# EAGLE schematic led-er-v3 (EAGLE 7.5.0)
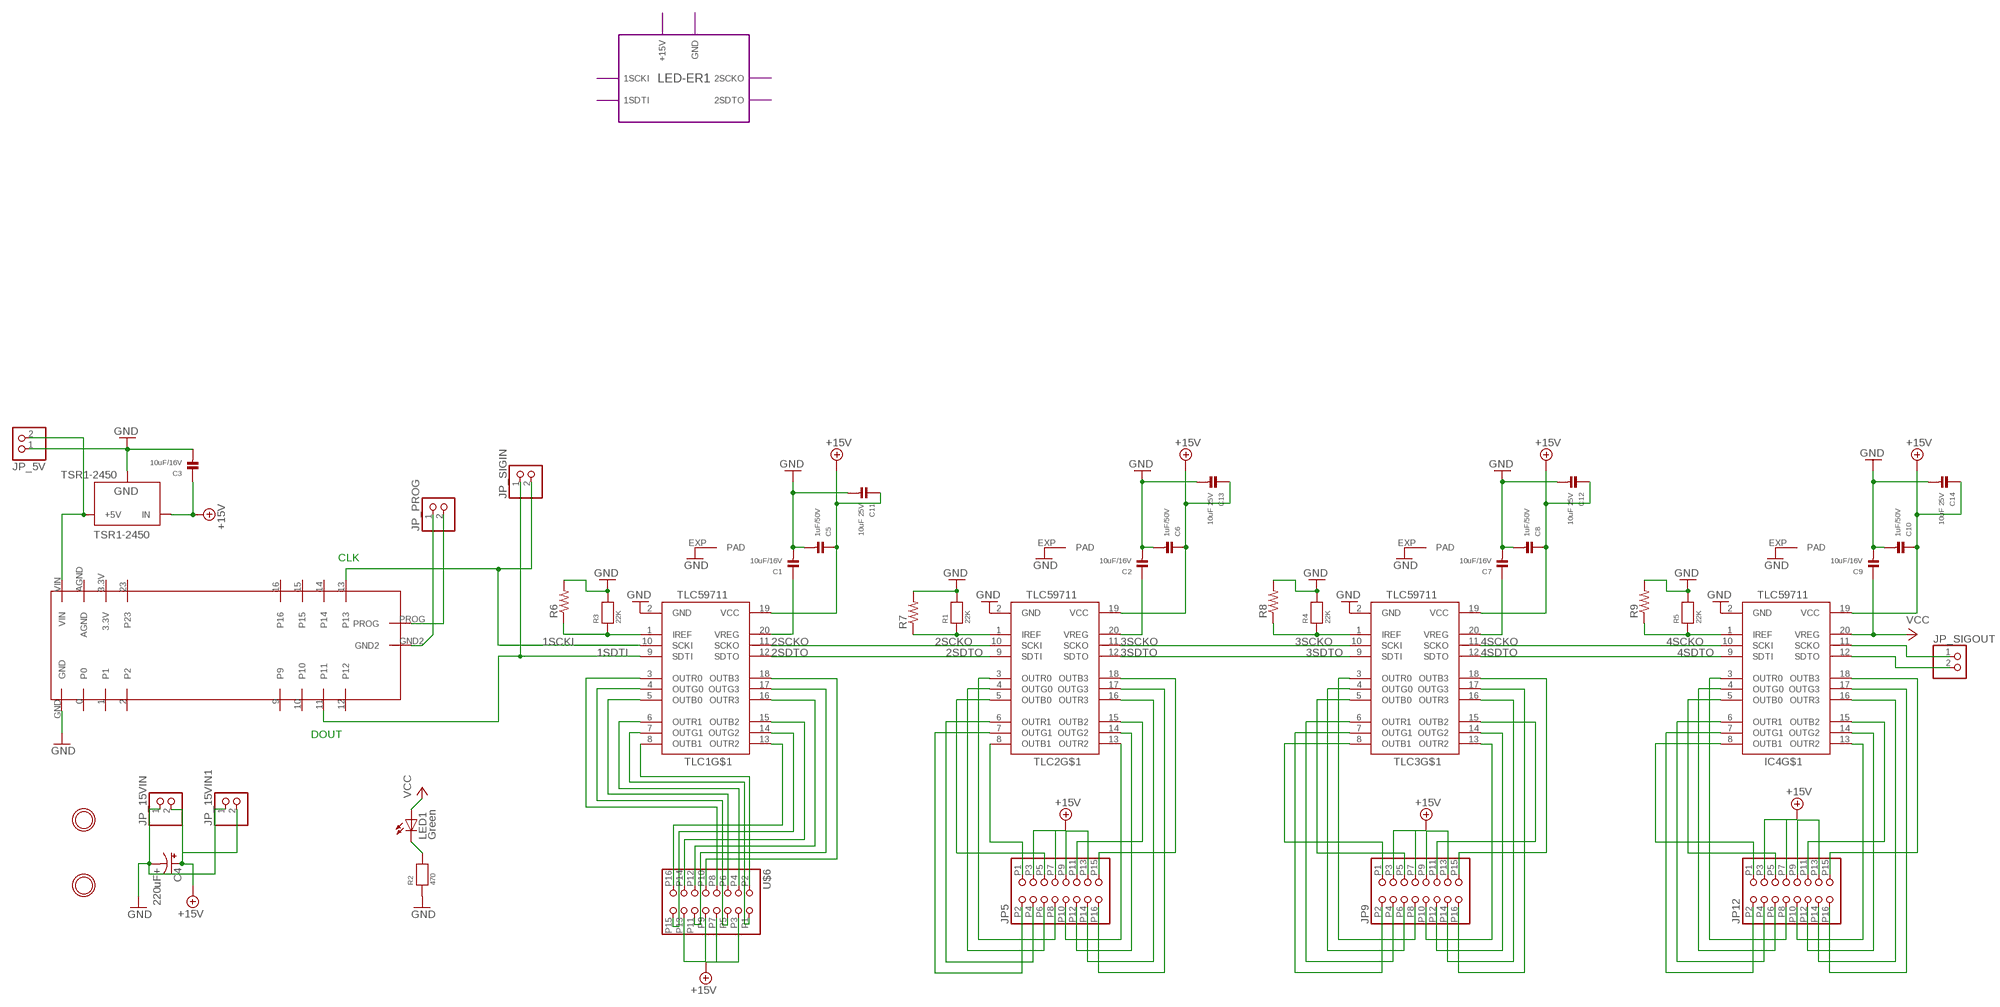
[diagram p0: schematic, sheet 1]

## Parts
C1  10uF/16V  CAP_CERAMIC0805  [0805]
C2  10uF/16V  CAP_CERAMIC0805  [0805]
C3  10uF/16V  CAP_CERAMIC0805  [0805]
C4  220uF+  CPOL-USE5-8.5  [E5-8,5]
C5  1uF/50V  CAP_CERAMIC0805  [0805]
C6  1uF/50V  CAP_CERAMIC0805  [0805]
C7  10uF/16V  CAP_CERAMIC0805  [0805]
C8  1uF/50V  CAP_CERAMIC0805  [0805]
C9  10uF/16V  CAP_CERAMIC0805  [0805]
C10  1uF/50V  CAP_CERAMIC0805  [0805]
C11  10uF 25V  CAP_CERAMIC0805  [0805]
C12  10uF 25V  CAP_CERAMIC0805  [0805]
C13  10uF 25V  CAP_CERAMIC0805  [0805]
C14  10uF 25V  CAP_CERAMIC0805  [0805]
IC4  TLC59711  [HTSSOP20DAP]
JP5  HEADER-2X8-RIBBON  [2X08_RIBBON]
JP9  HEADER-2X8-RIBBON  [2X08_RIBBON]
JP12  HEADER-2X8-RIBBON  [2X08_RIBBON]
JP_5V  HEADER-1X2  [1X02_OVAL]
JP_15VIN  HEADER-1X2  [1X02_OVAL]
JP_15VIN1  HEADER-1X2  [1X02_OVAL]
JP_PROG  HEADER-1X2  [1X02_OVAL]
JP_SIGIN  HEADER-1X2  [1X02_OVAL]
JP_SIGOUT  HEADER-1X2  [1X02_OVAL]
LED1  Green  LEDCHIP-LED0805  [CHIP-LED0805]
R1  22K  RESISTOR0805  [0805]
R2  470  RESISTOR0805  [0805]
R3  22K  RESISTOR0805  [0805]
R4  22K  RESISTOR0805  [0805]
R5  22K  RESISTOR0805  [0805]
R6  R-US_0207/9  [0207/9]
R7  R-US_0207/10  [0207/10]
R8  R-US_0207/9  [0207/9]
R9  R-US_0207/9  [0207/9]
TLC1  TLC59711  [HTSSOP20DAP]
TLC2  TLC59711  [HTSSOP20DAP]
TLC3  TLC59711  [HTSSOP20DAP]
TSR1-2450  TSR1-2450  [TSR-1]
U$1  MOUNTINGHOLE  [MOUNTINGHOLE_3.0_PLATED]
U$3  MOUNTINGHOLE  [MOUNTINGHOLE_3.0_PLATED]
U$5  TEENSY_LEDER  [TEENSY_LEDER]
U$6  HEADER-2X8-RIBBON  [2X08_RIBBON]

## Module instances
LED-ER1 = LED-ER

## Nets
1SCKI: JP_SIGIN.2 TLC1.10(SCKI) U$5.13
1SDTI: JP_SIGIN.1 TLC1.9(SDTI) U$5.11
2SCKO: TLC1.11(SCKO) TLC2.10(SCKI)
2SDTO: TLC1.12(SDTO) TLC2.9(SDTI)
3SCKO: TLC2.11(SCKO) TLC3.10(SCKI)
3SDTO: TLC2.12(SDTO) TLC3.9(SDTI)
4SCKO: IC4.10(SCKI) TLC3.11(SCKO)
4SDTO: IC4.9(SDTI) TLC3.12(SDTO)
+15V: C3.1 C4.+ C5.1 C6.1 C8.1 C10.1 C11.1 C12.1 C13.1 C14.1 IC4.19(VCC) JP5.P3 JP5.P7 JP5.P9 JP5.P13 JP9.P3 JP9.P7 JP9.P9 JP9.P13 JP12.P3 JP12.P7 JP12.P9 JP12.P13 JP_15VIN1.2 JP_15VIN.2 TLC1.19(VCC) TLC2.19(VCC) TLC3.19(VCC) TSR1-2450.1(IN) U$6.P3 U$6.P7 U$6.P9 U$6.P13
GND: C1.2 C2.2 C3.2 C4.- C5.2 C6.2 C7.2 C8.2 C9.2 C10.2 C11.2 C12.2 C13.2 C14.2 IC4.2(GND) IC4.EXP(PAD) JP_5V.1 JP_15VIN1.1 JP_15VIN.1 R1.2 R2.1 R3.2 R4.2 R5.2 R6.2 R7.2 R8.2 R9.2 TLC1.2(GND) TLC1.EXP(PAD) TLC2.2(GND) TLC2.EXP(PAD) TLC3.2(GND) TLC3.EXP(PAD) TSR1-2450.2(GND) U$5.GND
JP1: JP_5V.2 TSR1-2450.3(+5V) U$5.VIN
N$1: LED1.C R2.2
N$2: R3.1 R6.1 TLC1.1(IREF)
N$3: TLC1.8(OUTB1) U$6.P2
N$4: TLC1.7(OUTG1) U$6.P1
N$5: TLC1.6(OUTR1) U$6.P4
N$6: TLC1.5(OUTB0) U$6.P6
N$7: JP5.P2 TLC2.7(OUTG1)
N$8: JP5.P4 TLC2.6(OUTR1)
N$9: JP5.P5 TLC2.5(OUTB0)
N$10: JP5.P6 TLC2.4(OUTG0)
N$11: TLC1.4(OUTG0) U$6.P5
N$12: TLC1.3(OUTR0) U$6.P8
N$13: TLC1.15(OUTB2) U$6.P14
N$14: TLC1.18(OUTB3) U$6.P10
N$15: R1.1 R7.1 TLC2.1(IREF)
N$16: JP9.P1 TLC3.8(OUTB1)
N$17: JP5.P10 TLC2.13(OUTR2)
N$18: JP9.P6 TLC3.4(OUTG0)
N$19: IC4.7(OUTG1) JP12.P2
N$20: JP9.P2 TLC3.7(OUTG1)
N$21: IC4.6(OUTR1) JP12.P4
N$22: JP9.P4 TLC3.6(OUTR1)
N$23: JP5.P12 TLC2.14(OUTG2)
N$24: JP5.P11 TLC2.15(OUTB2)
N$25: JP5.P14 TLC2.16(OUTR3)
N$26: JP5.P16 TLC2.17(OUTG3)
N$27: JP5.P15 TLC2.18(OUTB3)
N$28: R4.1 R8.1 TLC3.1(IREF)
N$29: JP9.P12 TLC3.14(OUTG2)
N$30: JP5.P1 TLC2.8(OUTB1)
N$31: JP9.P10 TLC3.13(OUTR2)
N$32: TLC1.17(OUTG3) U$6.P11
N$33: TLC1.16(OUTR3) U$6.P12
N$34: TLC1.14(OUTG2) U$6.P15
N$35: TLC1.13(OUTR2) U$6.P16
N$37: JP9.P11 TLC3.15(OUTB2)
N$38: JP9.P14 TLC3.16(OUTR3)
N$39: JP9.P16 TLC3.17(OUTG3)
N$40: JP9.P15 TLC3.18(OUTB3)
N$41: IC4.1(IREF) R5.1 R9.1
N$42: JP5.P8 TLC2.3(OUTR0)
N$43: IC4.13(OUTR2) JP12.P10
N$44: JP9.P5 TLC3.5(OUTB0)
N$49: IC4.14(OUTG2) JP12.P12
N$50: IC4.15(OUTB2) JP12.P11
N$51: IC4.16(OUTR3) JP12.P14
N$52: IC4.17(OUTG3) JP12.P16
N$53: IC4.18(OUTB3) JP12.P15
N$54: JP_PROG.1 U$5.GND2
N$55: JP_PROG.2 U$5.PROG
N$56: C1.1 TLC1.20(VREG)
N$57: C7.1 TLC3.20(VREG)
N$58: C2.1 TLC2.20(VREG)
N$59: IC4.11(SCKO) JP_SIGOUT.1
N$60: IC4.12(SDTO) JP_SIGOUT.2
N$61: JP9.P8 TLC3.3(OUTR0)
N$62: IC4.3(OUTR0) JP12.P8
N$71: IC4.4(OUTG0) JP12.P6
N$79: IC4.5(OUTB0) JP12.P5
N$80: IC4.8(OUTB1) JP12.P1
VCC: C9.1 IC4.20(VREG) LED1.A
Unconnected: U$5.0 U$5.1 U$5.2 U$5.3.3V U$5.9 U$5.10 U$5.12 U$5.14 U$5.15 U$5.16 U$5.23 U$5.AGND

## Notes on the sheet
- CLK
- DOUT

## Library data of the parts
C1-C3 C5-C14 = microbuilder:CAP_CERAMIC: Ceramic Capacitors 0402 - 0402 Surface Mount Capacitors 16pF 50V 5% [Digikey: 445-4899-2-ND] 18pF 50V 5% [Digikey: 490-1281-2-ND] 22pF 50V 5% [Digikey: 490-1283-2-ND] 68pF 50V 5% [Digikey: 490-1289-2-ND] 0.1uF 10V 10% [Digikey: 490-1318-2-ND] 1.0uF 6.3V 10% [Digikey: 490-1320-2-ND] 0603 - 0603 Surface Mount Capacitors 16 pF 50V 5% [Digikey: 445-5051-2-ND] 22 pF 50V [Digikey: PCC220ACVTR-ND] 33 pF 50V 5% [Digikey: 490-1415-1-ND] 56pF 50V 5% [Digikey: 490-1421-1-ND] 220pF 50V 5% [Digikey: 445-1285-1-ND] 680 pF 50V 2200 pF 50V 5% C0G [Digikey: 445-1297-1-ND] 5600 pF 100V 5% X7R [Digikey: 478-3711-1-ND] 0.1 µF 25V 10% [Digikey: PCC2277TR-ND] 0.22 µF 16V 10% X7R [Digikey: 445-1318-1-ND] 1.0 µF 25V 10% [Digikey: 445-5146-2-ND] 0603 - RF Specific 3pF 250V +/-0.1pF RF [Digikey: 712-1347-1-ND] 18 pF 250V 5% [Digikey: 478-3505-1-ND or 712-1322-1-ND] 56 pF 250V 5% C0G RF [Digikey: 490-4867-1-ND] 68 pF 250V RF [Digikey: 490-4868-1-ND] 0805 - 0805 Surface Mount Capacitors 220 pF 250V 2% RF Ceramic Capacitor [Digikey: 712-1398-1-ND] 1000 pF 50V 2% NP0 Ceramic Capacitor [Digikey: 478-3760-1-ND] 0.1 µF 25V 10% Ceramic Capacitor [Digikey: PCC1828TR-ND] 1.0 µF 16V 10% Ceramic Capacitor[Digikey: 490-1691-2-ND] 10.0 µF 10V 10% Ceramic Capacitor[Digikey: 709-1228-1-ND] 10.0 uF 16V 10% Ceramic Capacitor [Digikey: 478-5165-2-ND] 47 uF 6.3V 20% Ceramic Capacitor [Digikey: 587-1779-1-ND or 399-5506-1-ND] 1206 - 1206 Surface Mount Capacitors 47uF 10V 20% Ceramic Capacitor [Digikey: 490-5528-1-ND or 399-5508-1-ND or 445-6010-1-ND] 100uF 6.3V -20%, +80% Y5V Ceramic Capacitor (Digikey: 490-4512-1-ND, Mouser: 81-GRM31CF50J107ZE1L)
C4 = adafruit:CPOL-US: POLARIZED CAPACITOR, American symbol
IC4 TLC1-TLC3 = adafruit:TLC59711
JP5 JP9 JP12 U$6 = Andrews:HEADER-2X8-RIBBON
JP_5V JP_15VIN JP_15VIN1 JP_PROG JP_SIGIN JP_SIGOUT = microbuilder:HEADER-1X2: PIN HEADER
LED1 = adafruit:LED: LED OSRAM: - CHIPLED LG R971, LG N971, LY N971, LG Q971, LY Q971, LO R971, LY R971 LH N974, LH R974 LS Q976, LO Q976, LY Q976 LO Q996 - Hyper CHIPLED LW Q18S LB Q993, LB Q99A, LB R99A - SideLED LS A670, LO A670, LY A670, LG A670, LP A670 LB A673, LV A673, LT A673, LW A673 LH A674 LY A675 LS A676, LA A676, LO A676, LY A676, LW A676 LS A679, LY A679, LG A679 - Hyper Micro SIDELED® LS Y876, LA Y876, LO Y876, LY Y876 LT Y87S - SmartLED LW L88C, LW L88S LB L89C, LB L89S, LG L890 LS L89K, LO L89K, LY L89K LS L896, LA L896, LO L896, LY L896 - TOPLED LS T670, LO T670, LY T670, LG T670, LP T670 LSG T670, LSP T670, LSY T670, LOP T670, LYG T670 LG T671, LOG T671, LSG T671 LB T673, LV T673, LT T673, LW T673 LH T674 LS T676, LA T676, LO T676, LY T676, LB T676, LH T676, LSB T676, LW T676 LB T67C, LV T67C, LT T67C, LS T67K, LO T67K, LY T67K, LW E67C LS E67B, LA E67B, LO E67B, LY E67B, LB E67C, LV E67C, LT E67C LW T67C LS T679, LY T679, LG T679 LS T770, LO T770, LY T770, LG T770, LP T770 LB T773, LV T773, LT T773, LW T773 LH T774 LS E675, LA E675, LY E675, LS T675 LS T776, LA T776, LO T776, LY T776, LB T776 LHGB T686 LT T68C, LB T68C - Hyper Mini TOPLED® LB M676 - Mini TOPLED Santana® LG M470 LS M47K, LO M47K, LY M47K Source: http://www.osram.convergy.de/
R1-R5 = microbuilder:RESISTOR: Resistors 0402 - 0402 Surface Mount Package 22 Ohm 1% 1/16W [Digikey: 311-22.0LRTR-ND] 33 Ohm 5% 1/16W 1.0K 5% 1/16W 1.5K 5% 1/16W 2.0K 1% 1/16W 10.0K 1% 1/16W [Digikey: 311-10.0KLRTR-ND] 10.0K 5% 1/16W [Digikey: RMCF0402JT10K0TR-ND] 12.1K 1% 1/16W [Digikey: 311-22.0LRTR-ND] 100.0K 5% 1/16W 0603 - 0603 Surface Mount Package 0 Ohm 1/10 Watt 1% Resistor 15 Ohm 1/10 Watt 1% Resistor 33 Ohm 1/10 Watt 1% Resistor 49.9 Ohm 1/10 Watt 1% Resistor 100 Ohm 1/10 Watt 1% Resistor 150 Ohm 1/10 Watt 1% Resistor 240 Ohm 1/10 Watt 1% Resistor 390 Ohm 1/10 Watt 1% Resistor 560 Ohm 1/10 Watt 1% Resistor 680 Ohm 1/10 Watt 1% Resistor 750 Ohm 1/10 Watt 1% Resistor 1.0K Ohm 1/10 Watt 1% Resistor 1.5K Ohm 1/10 Watt 1% Resistor 2.0K Ohm 1/10 Watt 1% Resistor 2.2K Ohm 1/10 Watt 1% Resistor 3.3K Ohm 1/10 Watt 1% Resistor 4.7K Ohm 1/10 Watt 1% Resistor 10.0K Ohm 1/10 Watt 1% Resistor 12.0K Ohm 1/10 Watt 1% Resistor 12.1K Ohm 1/10 Watt 1% Resistor 20.0K Ohm 1/10 Watt 1% Resistor 33.0K Ohm 1/10 Watt 1% Resistor 100.0K Ohm 1/10 Watt 1% Resistor 0805 - 0805 Surface Mount Package 0 Ohm 1/8 Watt 1% Resistor 33 Ohm 1/8 Watt 1% Resistor 100 Ohm 1/8 Watt 1% Resistor 150 Ohm 1/8 Watt 1% Resistor 200 Ohm 1/8 Watt 1% Resistor 240 Ohm 1/8 Watt 1% Resistor 330 Ohm 1/8 Watt 1% Resistor 390 Ohm 1/8 Watt 1% Resistor 470 Ohm 1/8 Watt 1% Resistor 1.0K Ohm 1/8 Watt 1% Resistor 1.5K Ohm 1/8 Watt 1% Resistor 2.0K Ohm 1/8 Watt 1% Resistor 4.7K Ohm 1/8 Watt 1% Resistor 5.1K Ohm 1/8 Watt 1% Resistor 5.6K Ohm 1/8 Watt 1% Resistor 10.0K Ohm 1/8 Watt 1% Resistor 22.0K Ohm 1/8 Watt 1% Resistor 33.0K Ohm 1/8 Watt 1% Resistor 100K Ohm 1/8 Watt 1% Resistor 1206 - 1206 Surface Mount Package 2012 - 2010 Surface Mount Package 0.11 Ohm 1/2 Watt 1% Resistor - Digikey: RHM.11UCT-ND
R6-R9 = adafruit:R-US_: RESISTOR, American symbol
TSR1-2450 = SteelCaveRobotics-Power:TSR1-2450: Traco Power TSR 1-2450 5.0v switching regulator
U$1 U$3 = microbuilder:MOUNTINGHOLE: Mounting Hole For #2 screws (0.086"/2.18mm width, 0.094"/2.4mm hole) use 2.5mm
U$5 = Andrews:TEENSY_LEDER

## Module LED-ER
Ports: 1SCKI(io) 1SDTI(io) 2SCKO(io) 2SDTO(io) +15V(io) GND(io)
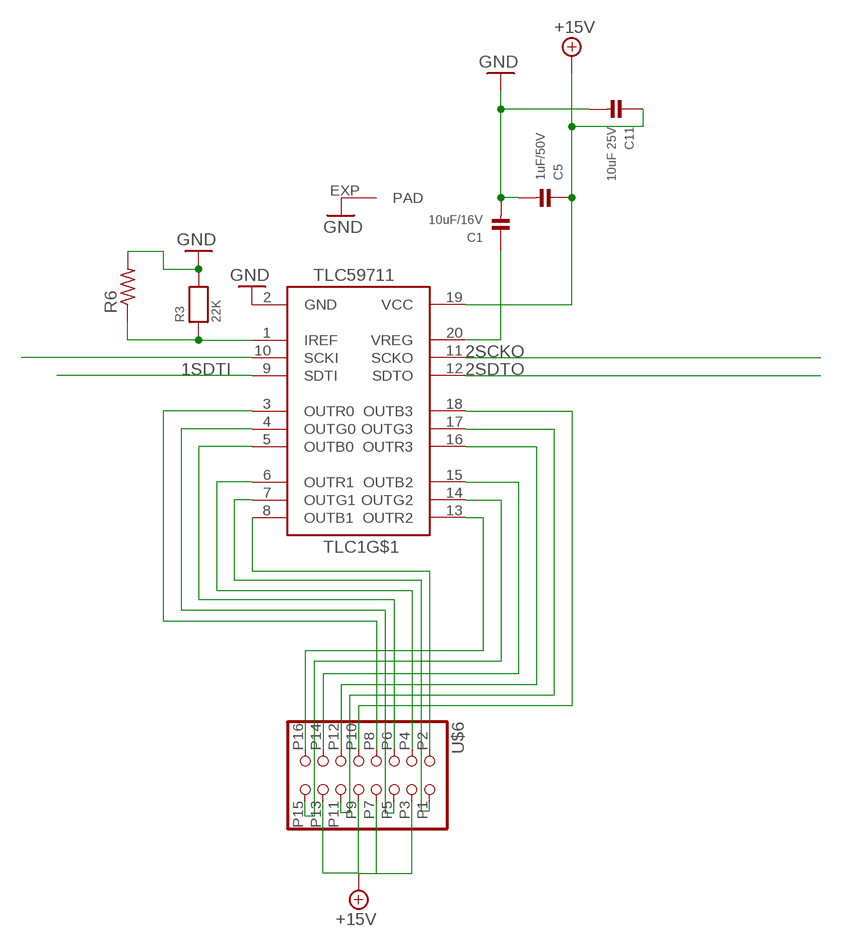
[diagram p1: schematic, module LED-ER, sheet 1]

### Parts
C1  10uF/16V  CAP_CERAMIC0805  [0805]
C5  1uF/50V  CAP_CERAMIC0805  [0805]
C11  10uF 25V  CAP_CERAMIC0805  [0805]
R3  22K  RESISTOR0805  [0805]
R6  R-US_0207/9  [0207/9]
TLC1  TLC59711  [HTSSOP20DAP]
U$6  HEADER-2X8-RIBBON  [2X08_RIBBON]

### Nets
1SCKI: TLC1.10(SCKI)
1SDTI: TLC1.9(SDTI)
2SCKO: TLC1.11(SCKO)
2SDTO: TLC1.12(SDTO)
+15V: C5.1 C11.1 TLC1.19(VCC) U$6.P3 U$6.P7 U$6.P9 U$6.P13
GND: C1.2 C5.2 C11.2 R3.2 R6.2 TLC1.2(GND) TLC1.EXP(PAD)
N$2: R3.1 R6.1 TLC1.1(IREF)
N$3: TLC1.8(OUTB1) U$6.P2
N$4: TLC1.7(OUTG1) U$6.P1
N$5: TLC1.6(OUTR1) U$6.P4
N$6: TLC1.5(OUTB0) U$6.P6
N$11: TLC1.4(OUTG0) U$6.P5
N$12: TLC1.3(OUTR0) U$6.P8
N$13: TLC1.15(OUTB2) U$6.P14
N$14: TLC1.18(OUTB3) U$6.P10
N$32: TLC1.17(OUTG3) U$6.P11
N$33: TLC1.16(OUTR3) U$6.P12
N$34: TLC1.14(OUTG2) U$6.P15
N$35: TLC1.13(OUTR2) U$6.P16
N$56: C1.1 TLC1.20(VREG)

### Library data of the parts
C1 C5 C11 = microbuilder:CAP_CERAMIC: Ceramic Capacitors 0402 - 0402 Surface Mount Capacitors 16pF 50V 5% [Digikey: 445-4899-2-ND] 18pF 50V 5% [Digikey: 490-1281-2-ND] 22pF 50V 5% [Digikey: 490-1283-2-ND] 68pF 50V 5% [Digikey: 490-1289-2-ND] 0.1uF 10V 10% [Digikey: 490-1318-2-ND] 1.0uF 6.3V 10% [Digikey: 490-1320-2-ND] 0603 - 0603 Surface Mount Capacitors 16 pF 50V 5% [Digikey: 445-5051-2-ND] 22 pF 50V [Digikey: PCC220ACVTR-ND] 33 pF 50V 5% [Digikey: 490-1415-1-ND] 56pF 50V 5% [Digikey: 490-1421-1-ND] 220pF 50V 5% [Digikey: 445-1285-1-ND] 680 pF 50V 2200 pF 50V 5% C0G [Digikey: 445-1297-1-ND] 5600 pF 100V 5% X7R [Digikey: 478-3711-1-ND] 0.1 µF 25V 10% [Digikey: PCC2277TR-ND] 0.22 µF 16V 10% X7R [Digikey: 445-1318-1-ND] 1.0 µF 25V 10% [Digikey: 445-5146-2-ND] 0603 - RF Specific 3pF 250V +/-0.1pF RF [Digikey: 712-1347-1-ND] 18 pF 250V 5% [Digikey: 478-3505-1-ND or 712-1322-1-ND] 56 pF 250V 5% C0G RF [Digikey: 490-4867-1-ND] 68 pF 250V RF [Digikey: 490-4868-1-ND] 0805 - 0805 Surface Mount Capacitors 220 pF 250V 2% RF Ceramic Capacitor [Digikey: 712-1398-1-ND] 1000 pF 50V 2% NP0 Ceramic Capacitor [Digikey: 478-3760-1-ND] 0.1 µF 25V 10% Ceramic Capacitor [Digikey: PCC1828TR-ND] 1.0 µF 16V 10% Ceramic Capacitor[Digikey: 490-1691-2-ND] 10.0 µF 10V 10% Ceramic Capacitor[Digikey: 709-1228-1-ND] 10.0 uF 16V 10% Ceramic Capacitor [Digikey: 478-5165-2-ND] 47 uF 6.3V 20% Ceramic Capacitor [Digikey: 587-1779-1-ND or 399-5506-1-ND] 1206 - 1206 Surface Mount Capacitors 47uF 10V 20% Ceramic Capacitor [Digikey: 490-5528-1-ND or 399-5508-1-ND or 445-6010-1-ND] 100uF 6.3V -20%, +80% Y5V Ceramic Capacitor (Digikey: 490-4512-1-ND, Mouser: 81-GRM31CF50J107ZE1L)
R3 = microbuilder:RESISTOR: Resistors 0402 - 0402 Surface Mount Package 22 Ohm 1% 1/16W [Digikey: 311-22.0LRTR-ND] 33 Ohm 5% 1/16W 1.0K 5% 1/16W 1.5K 5% 1/16W 2.0K 1% 1/16W 10.0K 1% 1/16W [Digikey: 311-10.0KLRTR-ND] 10.0K 5% 1/16W [Digikey: RMCF0402JT10K0TR-ND] 12.1K 1% 1/16W [Digikey: 311-22.0LRTR-ND] 100.0K 5% 1/16W 0603 - 0603 Surface Mount Package 0 Ohm 1/10 Watt 1% Resistor 15 Ohm 1/10 Watt 1% Resistor 33 Ohm 1/10 Watt 1% Resistor 49.9 Ohm 1/10 Watt 1% Resistor 100 Ohm 1/10 Watt 1% Resistor 150 Ohm 1/10 Watt 1% Resistor 240 Ohm 1/10 Watt 1% Resistor 390 Ohm 1/10 Watt 1% Resistor 560 Ohm 1/10 Watt 1% Resistor 680 Ohm 1/10 Watt 1% Resistor 750 Ohm 1/10 Watt 1% Resistor 1.0K Ohm 1/10 Watt 1% Resistor 1.5K Ohm 1/10 Watt 1% Resistor 2.0K Ohm 1/10 Watt 1% Resistor 2.2K Ohm 1/10 Watt 1% Resistor 3.3K Ohm 1/10 Watt 1% Resistor 4.7K Ohm 1/10 Watt 1% Resistor 10.0K Ohm 1/10 Watt 1% Resistor 12.0K Ohm 1/10 Watt 1% Resistor 12.1K Ohm 1/10 Watt 1% Resistor 20.0K Ohm 1/10 Watt 1% Resistor 33.0K Ohm 1/10 Watt 1% Resistor 100.0K Ohm 1/10 Watt 1% Resistor 0805 - 0805 Surface Mount Package 0 Ohm 1/8 Watt 1% Resistor 33 Ohm 1/8 Watt 1% Resistor 100 Ohm 1/8 Watt 1% Resistor 150 Ohm 1/8 Watt 1% Resistor 200 Ohm 1/8 Watt 1% Resistor 240 Ohm 1/8 Watt 1% Resistor 330 Ohm 1/8 Watt 1% Resistor 390 Ohm 1/8 Watt 1% Resistor 470 Ohm 1/8 Watt 1% Resistor 1.0K Ohm 1/8 Watt 1% Resistor 1.5K Ohm 1/8 Watt 1% Resistor 2.0K Ohm 1/8 Watt 1% Resistor 4.7K Ohm 1/8 Watt 1% Resistor 5.1K Ohm 1/8 Watt 1% Resistor 5.6K Ohm 1/8 Watt 1% Resistor 10.0K Ohm 1/8 Watt 1% Resistor 22.0K Ohm 1/8 Watt 1% Resistor 33.0K Ohm 1/8 Watt 1% Resistor 100K Ohm 1/8 Watt 1% Resistor 1206 - 1206 Surface Mount Package 2012 - 2010 Surface Mount Package 0.11 Ohm 1/2 Watt 1% Resistor - Digikey: RHM.11UCT-ND
R6 = adafruit:R-US_: RESISTOR, American symbol
TLC1 = adafruit:TLC59711
U$6 = Andrews:HEADER-2X8-RIBBON